# Altium schematic sheet sensor-1.SchDoc
size Letter
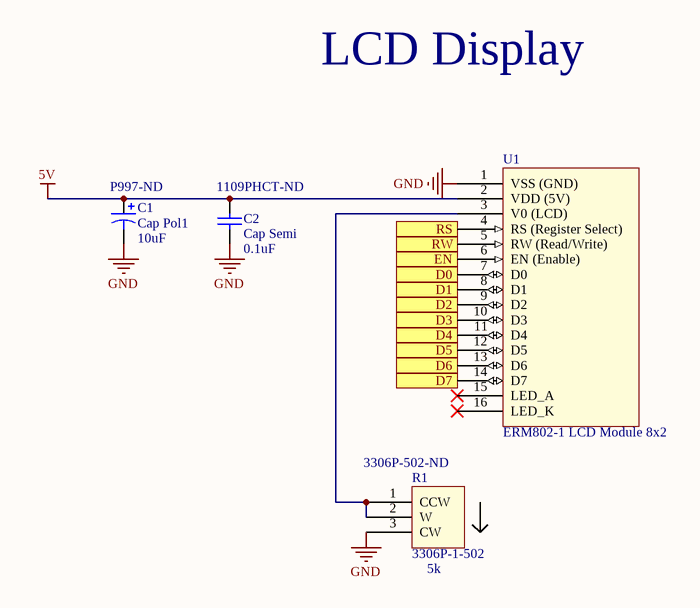
[diagram p0: sensor-1.SchDoc]

## Parts
C1  Cap Pol1  value 10uF  Supplier Part Number 1: P997-ND  [ECE-A1HKS100]
C2  Cap Semi  value 0.1uF  Supplier Part Number 1: 1109PHCT-ND  [A104K15X7RF5TAA]
R1  3306P-1-502  Supplier Part Number 1: 3306P-502-ND  [3306P-1-502]
U1  ERM802-1 LCD Module 8x2  [ERM802-1]

## Ports
D0, D1, D2, D3, D4, D5, D6, D7, EN, RS, RW

## Nets
5V: C1.1 C2.2 U1.2(VDD_(5V))
GND: C1.2 C2.1 R1.3(CW) U1.1(VSS_(GND))
D0: U1.7(D0) ; port D0
D1: U1.8(D1) ; port D1
D2: U1.9(D2) ; port D2
D3: U1.10(D3) ; port D3
D4: U1.11(D4) ; port D4
D5: U1.12(D5) ; port D5
D6: U1.13(D6) ; port D6
D7: U1.14(D7) ; port D7
EN: U1.6(EN_(Enable)) ; port EN
RS: U1.4(RS_(Register_Select)) ; port RS
RW: U1.5(RW_(Read/Write)) ; port RW
NetR1_1: R1.1(CCW) R1.2(W) U1.3(V0_(LCD))

Not connected (* = marked no-connect by the designer): U1 15(LED_A)* 16(LED_K)*

## Notes on the sheet
- LCD Display
- (near R1) 5k

## Library data of the parts
C1 = Cap Pol1: Polarized Capacitor (Radial); Manufacturer: Panasonic; Ripple Current: 35mA; Tolerance: 20%; Voltage Rating: 50V; Polarity: Polar; Life (Hours): 1000Hour; Leakage Current: 3A; Lead Diameter: 0.45mm; Published: 8-Jun-2000; LatestRevisionDate: 17-Jul-2002; LatestRevisionNote: Re-released for DXP Platform.; PackageReference: RB7.6-15; Publisher: Altium Limited; PackageDescription: Polarized Capacitor (Radial); 2 Leads; Supplier 1: Digi-Key; Manufacturer Part Number: ECE-A1HKS100; Stock 1: 132836; Pricing 1: 1=0.10000, 10=0.03000 (USD); RoHS: Yes; Mount: Through Hole,PCB; Case/Package: Radial; Number of Pins: 2; Weight: 0.01lb; Min Operating Temperature: -40°C; Max Operating Temperature: 85°C; Package Quantity: 200; Capacitance: 10uF; Packaging: Bulk; Voltage Rating (DC): 50V; Ripple Current (AC): 35mA; Termination: Radial; Voltage: 50V; Diameter: 6.3mm; Length: 5mm; Height: 5mm; Lead Pitch: 2.5mm; Width: 0.5inch; Height - Seated (Max): 0.197inch; Radiation Hardening: No; Lead Free: Lead Free; REACH SVHC: No SVHC; ComponentLink1URL: https://datasheet.ciiva.com/11778/0900766b800274c4-11778985.pdf?src-supplier=RSComponents; ComponentLink1Description: https://datasheet.ciiva.com/11778/0900766b800274c4-11778985.pdf?src-supplier=RSComponents; ComponentLink2URL: https://datasheet.ciiva.com/17536/aba0000ce15-17536597.pdf?src-supplier=Avnet+Europe; ComponentLink2Description: https://datasheet.ciiva.com/17536/aba0000ce15-17536597.pdf?src-supplier=Avnet+Europe; ComponentLink3URL: https://datasheet.ciiva.com/14594/70067878-14594328.pdf?src-supplier=Allied+Electronics; ComponentLink3Description: https://datasheet.ciiva.com/14594/70067878-14594328.pdf?src-supplier=Allied+Electronics; ComponentLink4URL: https://datasheet.ciiva.com/16205/aba0000ce15-16205737.pdf?src-supplier=Future+Electronics; ComponentLink4Description: https://datasheet.ciiva.com/16205/aba0000ce15-16205737.pdf?src-supplier=Future+Electronics; ComponentLink5URL: https://datasheet.ciiva.com/24025/a-e-461514-24025641.pdf?src-supplier=Mouser; ComponentLink5Description: https://datasheet.ciiva.com/24025/a-e-461514-24025641.pdf?src-supplier=Mouser; ComponentLink6URL: https://datasheet.ciiva.com/43459/1339471-43459545.pdf?src-supplier=Farnell; ComponentLink6Description: https://datasheet.ciiva.com/43459/1339471-43459545.pdf?src-supplier=Farnell; ComponentLink7URL: https://datasheet.ciiva.com/15166/getdatasheetpartid-169217-15166123.pdf?src-supplier=Verical; ComponentLink7Description: https://datasheet.ciiva.com/15166/getdatasheetpartid-169217-15166123.pdf?src-supplier=Verical; ComponentLink8URL: https://datasheet.ciiva.com/46397/1339471-46397117.pdf?src-supplier=Element14; ComponentLink8Description: https://datasheet.ciiva.com/46397/1339471-46397117.pdf?src-supplier=Element14; ComponentLink9URL: https://datasheet.ciiva.com/2983/aba0000ce15-2983886.pdf?src-supplier=Avnet; ComponentLink9Description: https://datasheet.ciiva.com/2983/aba0000ce15-2983886.pdf?src-supplier=Avnet
C2 = Cap Semi: Capacitor (Semiconductor SIM Model); Manufacturer: Vishay BCcomponents; Capacitance: 100nF; Voltage Rating: 50V; Tolerance: 10%; Dielectric: X7R; Lead Length: 24.3mm; Lead Diameter: 0.5mm; Published: 8-Jun-2000; LatestRevisionDate: 29-May-2009; LatestRevisionNote: IPC-7351 Footprint Added.; PackageReference: C1206; Publisher: Altium Limited; PackageDescription: Chip Capacitor; Supplier 1: Digi-Key; Manufacturer Part Number: A104K15X7RF5TAA; Stock 1: 502711; Pricing 1: 1=0.24000, 10=0.16500, 100=0.09350, 500=0.06598, 1000=0.05773, 2500=0.05498 (USD); RoHS: Yes; Mount: Through Hole,PCB,Axial; Case/Package: Dipped; Contact Plating: Tin; Min Operating Temperature: -55°C; Max Operating Temperature: 125°C; Package Quantity: 1; Packaging: Tape and Reel; Voltage Rating (DC): 50V; Termination: Axial; Voltage: 50V; Diameter: 2.5mm; Length: 3.8mm; Radiation Hardening: No; REACH SVHC: Unknown; Lead Free: Lead Free; ComponentLink1URL: https://datasheet.ciiva.com/145/aseries-145936.pdf?src-supplier=Digi-Key; ComponentLink1Description: https://datasheet.ciiva.com/145/aseries-145936.pdf?src-supplier=Digi-Key; ComponentLink2URL: https://datasheet.ciiva.com/5815/1734588-5815375.pdf?src-supplier=Farnell; ComponentLink2Description: https://datasheet.ciiva.com/5815/1734588-5815375.pdf?src-supplier=Farnell; ComponentLink3URL: https://datasheet.ciiva.com/18442/70122957-18442089.pdf?src-supplier=Allied+Electronics; ComponentLink3Description: https://datasheet.ciiva.com/18442/70122957-18442089.pdf?src-supplier=Allied+Electronics; ComponentLink4URL: https://datasheet.ciiva.com/2988/aseries-2988250.pdf?src-supplier=Avnet; ComponentLink4Description: https://datasheet.ciiva.com/2988/aseries-2988250.pdf?src-supplier=Avnet; ComponentLink5URL: https://datasheet.ciiva.com/17444/aseries-17444908.pdf?src-supplier=Avnet+Europe; ComponentLink5Description: https://datasheet.ciiva.com/17444/aseries-17444908.pdf?src-supplier=Avnet+Europe; ComponentLink6URL: https://datasheet.ciiva.com/46418/1796772-46418252.pdf?src-supplier=Element14; ComponentLink6Description: https://datasheet.ciiva.com/46418/1796772-46418252.pdf?src-supplier=Element14; ComponentLink7URL: https://datasheet.ciiva.com/145/aseries-145935.pdf?src-supplier=Digi-Key; ComponentLink7Description: https://datasheet.ciiva.com/145/aseries-145935.pdf?src-supplier=Digi-Key
R1 = 3306P-1-502: TRIMMER 5K OHM 0.2W PC PIN TOP; Manufacturer: Bourns; Resistance: 5kR; Tolerance: 25%; Power Rating: 200mW; Voltage Rating: 100V; Number of Turns: 1; Temperature Coefficient: 250ppm/°C; Pitch: 2.5mm; Supplier 1: Digi-Key; Manufacturer Part Number: 3306P-1-502; Stock 1: 2392; Pricing 1: 1=0.43000, 10=0.40000, 25=0.36000, 50=0.34800, 100=0.33600, 250=0.31200, 500=0.28800, 1000=0.27000, 5000=0.20400 (USD); RoHS: Yes; Mount: Through Hole,PCB; Weight: 360mg; Color: Blue; Contact Plating: Tin; Min Operating Temperature: -25°C; Max Operating Temperature: 100°C; Packaging: Bulk; Package Quantity: 200; Composition: Cermet; Termination: Pin; Taper: Linear; Military Standard: Not; Max Power Dissipation: 200mW; Diameter: 6.81mm; Length: 6.81mm; Height: 7.62mm; Width: 6.81mm; Depth: 8.1mm; Radiation Hardening: No; REACH SVHC: No SVHC; Lead Free: Lead Free; ComponentLink1URL: https://datasheet.ciiva.com/19466/769961-19466616.pdf?src-supplier=Jameco; ComponentLink1Description: https://datasheet.ciiva.com/19466/769961-19466616.pdf?src-supplier=Jameco; ComponentLink2URL: https://datasheet.ciiva.com/11830/0900766b80dbb841-11830858.pdf?src-supplier=RSComponents; ComponentLink2Description: https://datasheet.ciiva.com/11830/0900766b80dbb841-11830858.pdf?src-supplier=RSComponents; ComponentLink3URL: https://datasheet.ciiva.com/29122/447317-da-01-en-trimmer-tht3306p-1-502-5k-0-2w-29122254.pdf?src-supplier=Conrad; ComponentLink3Description: https://datasheet.ciiva.com/29122/447317-da-01-en-trimmer-tht3306p-1-502-5k-0-2w-29122254.pdf?src-supplier=Conrad; ComponentLink4URL: https://datasheet.ciiva.com/2160/3306-2160165.pdf?src-supplier=Digi-Key; ComponentLink4Description: https://datasheet.ciiva.com/2160/3306-2160165.pdf?src-supplier=Digi-Key; ComponentLink5URL: https://datasheet.ciiva.com/20163/67-0600-20163929.pdf?src-supplier=Rapid+Electronics; ComponentLink5Description: https://datasheet.ciiva.com/20163/67-0600-20163929.pdf?src-supplier=Rapid+Electronics; ComponentLink6URL: https://datasheet.ciiva.com/16715/70154382-16715498.pdf?src-supplier=Allied+Electronics; ComponentLink6Description: https://datasheet.ciiva.com/16715/70154382-16715498.pdf?src-supplier=Allied+Electronics; ComponentLink7URL: https://datasheet.ciiva.com/15157/getdatasheetpartid-379572-15157051.pdf?src-supplier=Verical; ComponentLink7Description: https://datasheet.ciiva.com/15157/getdatasheetpartid-379572-15157051.pdf?src-supplier=Verical; ComponentLink8URL: https://datasheet.ciiva.com/1477/1815113-1477453.pdf?src-supplier=Element14; ComponentLink8Description: https://datasheet.ciiva.com/1477/1815113-1477453.pdf?src-supplier=Element14
U1 = ERM802-1